# Altium schematic sheet Intercomm_sheet_2.SchDoc
size 594 x 420 mm; SheetNumber: 2; SheetTotal: 3
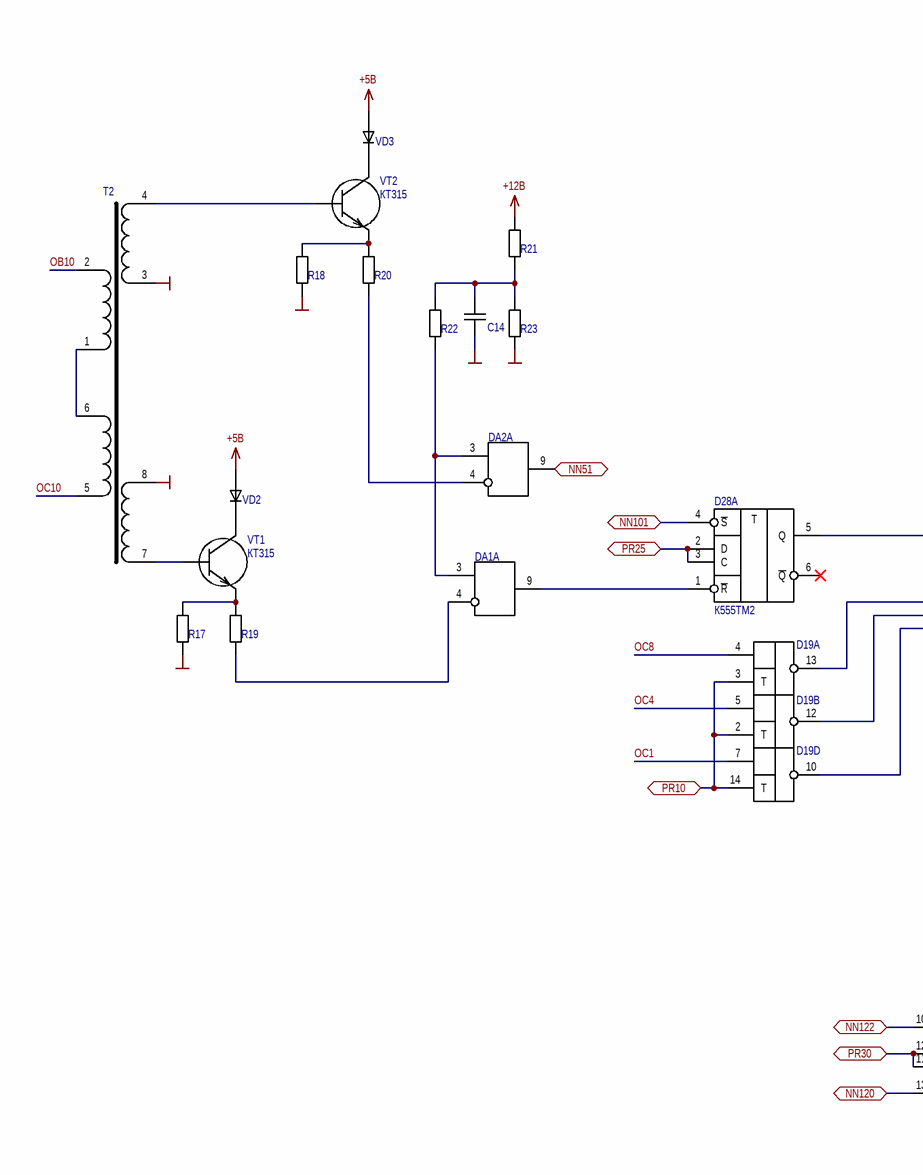
[diagram p0: Intercomm_sheet_2.SchDoc, left]
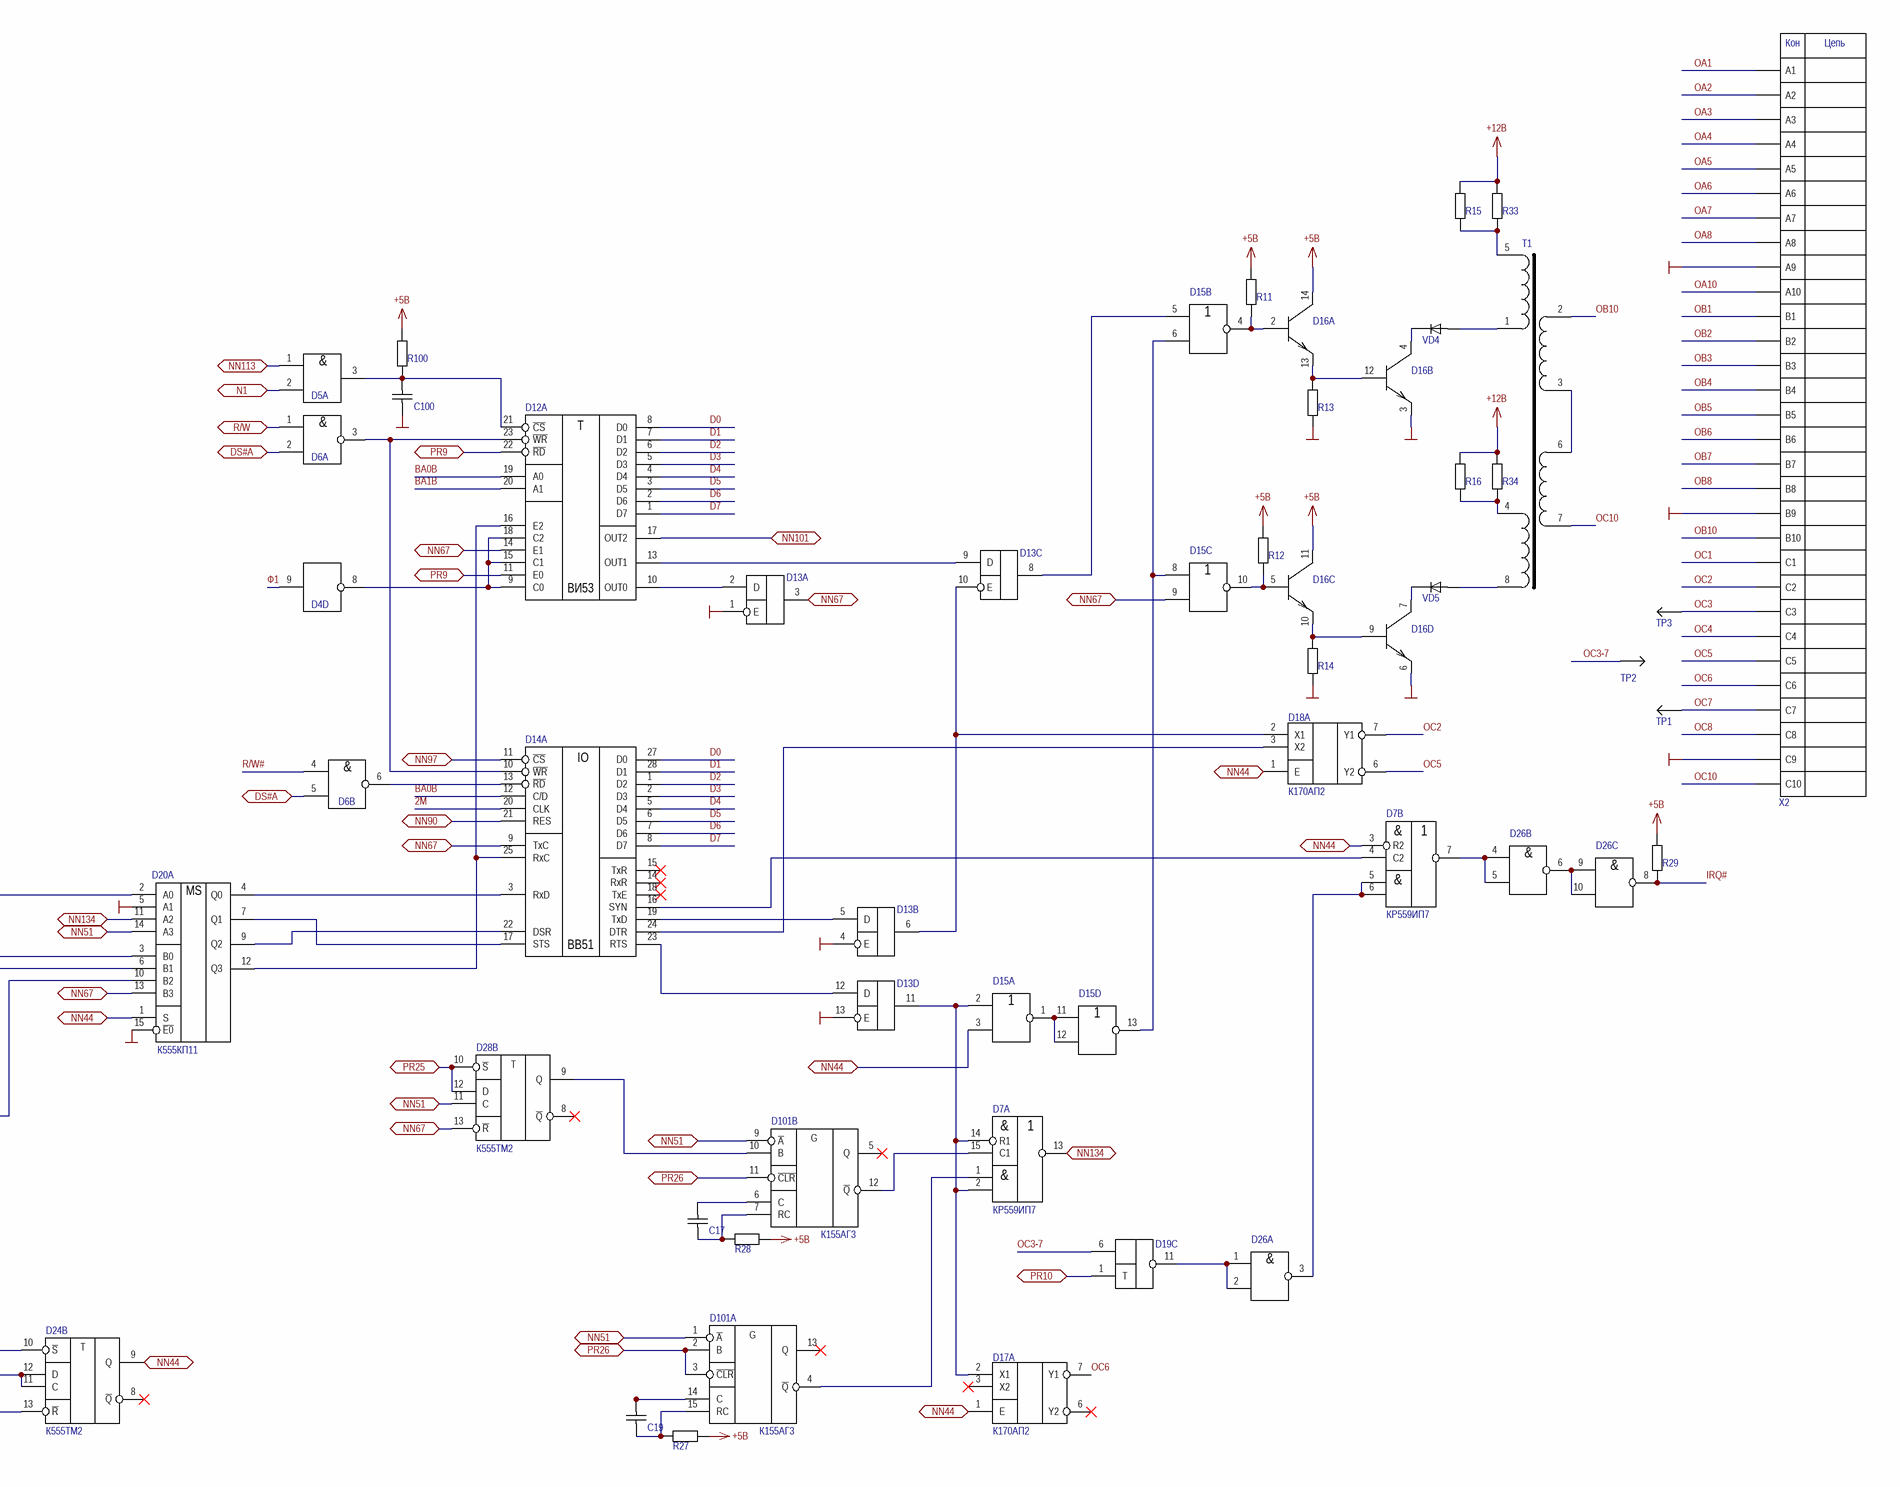
[diagram p1: Intercomm_sheet_2.SchDoc, right]

## Parts
C14  0,1  [C5]  (value not drawn)
C17  0,1  [C5]  (value not drawn)
C19  0,1  [C5]  (value not drawn)
C100  0,1  [C5]  (value not drawn)
D4  К555ТЛ2  [201.14]  (value not drawn)  (part D of 7)
D5  К555ЛИ1  [201.14]  (value not drawn)  (part A of 5)
D6  К555ЛА3  [201.14]  (value not drawn)  (parts A,B of 5)
D7  КР559ИП7  [201.16]  (parts A,B of 4)
D12  КР580ВИ53  [2120.24]  (value not drawn)  (part A of 2)
D13  К555ЛП8  [201.14]  (value not drawn)  (parts A,B,C,D of 5)
D14  КР580ВВ51А  [2121.28]  (value not drawn)  (part A of 2)
D15  К555ЛЕ1  [201.14]  (value not drawn)  (parts A,B,C,D of 5)
D16  1НТ251  [SOP125P1150X265-14N]  (value not drawn)  (parts A,B,C,D of 4)
D17  К170АП2  [2101.8]  (part A of 2)
D18  К170АП2  [2101.8]  (part A of 2)
D19  К170УП2  [201.16]  (value not drawn)  (parts A,B,C,D of 5)
D20  К555КП11  [201.16]  (part A of 2)
D24  К555ТМ2  [201.14]  (part B of 3)
D26  К555ЛА3  [201.14]  (value not drawn)  (parts A,B,C of 5)
D28  К555ТМ2  [201.14]  (parts A,B of 3)
D101  К155АГ3  [201.16]  (parts A,B of 3)
DA1  К554СА2  [201.14]  (value not drawn)  (part A of 2)
DA2  К554СА2  [201.14]  (value not drawn)  (part A of 2)
R11  1K  [R10]  (value not drawn)
R12  1K  [R10]  (value not drawn)
R13  1K  [R10]  (value not drawn)
R14  1K  [R10]  (value not drawn)
R15  1K  [R10]  (value not drawn)
R16  1K  [R10]  (value not drawn)
R17  1K  [R10]  (value not drawn)
R18  1K  [R10]  (value not drawn)
R19  1K  [R10]  (value not drawn)
R20  1K  [R10]  (value not drawn)
R21  1K  [R10]  (value not drawn)
R22  1K  [R10]  (value not drawn)
R23  1K  [R10]  (value not drawn)
R27  1K  [R10]  (value not drawn)
R28  1K  [R10]  (value not drawn)
R29  1K  [R10]  (value not drawn)
R33  1K  [R10]  (value not drawn)
R34  1K  [R10]  (value not drawn)
R100  1K  [R10]  (value not drawn)
T1  COMM_T1  [COMM_T]  (value not drawn)
T2  COMM_T2  [COMM_T]  (value not drawn)
TP1  TEST_PAD  [TEST_PAD]  (value not drawn)
TP2  TEST_PAD  [TEST_PAD]  (value not drawn)
TP3  TEST_PAD  [TEST_PAD]  (value not drawn)
VD2  КД522Б  [DO-35-10mm]  (value not drawn)
VD3  КД522Б  [DO-35-10mm]  (value not drawn)
VD4  КД522Б  [DO-35-10mm]  (value not drawn)
VD5  КД522Б  [DO-35-10mm]  (value not drawn)
VT1  КТ315  [КТ315]
VT2  КТ315  [КТ315]
X2  COMM_OUT  [СНП34-300/27х9,4Р-22-Р]  (value not drawn)

## Ports
DS#A (bidir, see Intercomm_sheet_1[2D], Intercomm_sheet_2[2B]), DS#A (bidir, see Intercomm_sheet_1[2D], Intercomm_sheet_2[2C]), N1 (bidir, see Intercomm_sheet_1[3A]), NN44 (bidir, see Intercomm_sheet_2[2C], Intercomm_sheet_2[2D], Intercomm_sheet_2[3C], Intercomm_sheet_2[3D]), NN44 (bidir, see Intercomm_sheet_2[2C], Intercomm_sheet_2[2D], Intercomm_sheet_2[3C], Intercomm_sheet_2[3D], Intercomm_sheet_2[4C]), NN44 (bidir, see Intercomm_sheet_2[2C], Intercomm_sheet_2[2D], Intercomm_sheet_2[3C], Intercomm_sheet_2[4C]), NN44 (bidir, see Intercomm_sheet_2[2C], Intercomm_sheet_2[3C], Intercomm_sheet_2[3D], Intercomm_sheet_2[4C]), NN44 (bidir, see Intercomm_sheet_2[2D], Intercomm_sheet_2[3C], Intercomm_sheet_2[3D], Intercomm_sheet_2[4C]), NN51 (bidir, see Intercomm_sheet_2[1C], Intercomm_sheet_2[2C], Intercomm_sheet_2[2D], Intercomm_sheet_2[3D]), NN51 (bidir, see Intercomm_sheet_2[1C], Intercomm_sheet_2[2C], Intercomm_sheet_2[3D]), NN51 (bidir, see Intercomm_sheet_2[1C], Intercomm_sheet_2[2D], Intercomm_sheet_2[3D]), NN51 (bidir, see Intercomm_sheet_2[2C], Intercomm_sheet_2[2D], Intercomm_sheet_2[3D]), NN67 (bidir, see Intercomm_sheet_2[2B], Intercomm_sheet_2[2C], Intercomm_sheet_2[2D], Intercomm_sheet_2[3C]), NN67 (bidir, see Intercomm_sheet_2[2B], Intercomm_sheet_2[2C], Intercomm_sheet_2[3C]), NN67 (bidir, see Intercomm_sheet_2[2C], Intercomm_sheet_2[2D], Intercomm_sheet_2[3C]), NN90 (bidir, see Intercomm_sheet_1[4A]), NN97 (bidir, see Intercomm_sheet_1[3A]), NN101 (bidir, see Intercomm_sheet_2[1C]), NN101 (bidir, see Intercomm_sheet_2[3B]), NN113 (bidir, see Intercomm_sheet_1[3A]), NN120 (bidir, see Intercomm_sheet_1[3A]), NN122 (bidir, see Intercomm_sheet_1[3A]), NN134 (bidir, see Intercomm_sheet_2[2C]), NN134 (bidir, see Intercomm_sheet_2[3D]), PR9 (bidir, see Intercomm_sheet_1[1B], Intercomm_sheet_1[1D], Intercomm_sheet_2[2B], Intercomm_sheet_3[4A]), PR10 (bidir, see Intercomm_sheet_2[1D], Intercomm_sheet_3[4A]), PR10 (bidir, see Intercomm_sheet_2[3D], Intercomm_sheet_3[4A]), PR25 (bidir, see Intercomm_sheet_2[1C], Intercomm_sheet_3[4A]), PR25 (bidir, see Intercomm_sheet_2[2C], Intercomm_sheet_3[4A]), PR26 (bidir, see Intercomm_sheet_2[3D], Intercomm_sheet_3[4B]), PR30 (bidir, see Intercomm_sheet_3[4B]), R/W (bidir, see Intercomm_sheet_1[2D], Intercomm_sheet_1[3B])

## Nets
+5В: D16.11(C) D16.14(C) R11.2 R12.2 R27.2 R28.2 R29.2 R100.2 VD2.1 VD3.1
+12В: R15.1 R16.1 R21.2 R33.1 R34.1
GND: C14.2 C100.2 D13.1(E) D13.4(E) D13.13(E) D16.3(E) D16.6(E) D20.5(A1) D20.15(~{E0}) R13.2 R14.2 R17.2 R18.2 R23.2 T2.3 T2.8 X2.A9 X2.B9 X2.C9
2M: D14.20(CLK)
BA0B: D12.19(A0) D14.12(C/D)
BA1B: D12.20(A1)
D0: D12.8(D0) D14.27(D0)
D1: D12.7(D1) D14.28(D1)
D2: D12.6(D2) D14.1(D2)
D3: D12.5(D3) D14.2(D3)
D4: D12.4(D4) D14.5(D4)
D5: D12.3(D5) D14.6(D5)
D6: D12.2(D6) D14.7(D6)
D7: D12.1(D7) D14.8(D7)
DS#A: D6.2(B) D6.5(B) ; port DS#A
IRQ#: D26.8(~{O}) R29.1
N1: D5.2(B) ; port N1
NN44: D7.3(R2) D15.3(B) D17.1(E) D18.1(E) D20.1(S) D24.9(Q) ; port NN44
NN51: D20.14(A3) D28.11(C) D101.1(~{A}) D101.9(~{A}) DA2.9(OUT) ; port NN51
NN67: D12.14(E1) D13.3(O) D14.9(TxC) D15.9(B) D20.13(B3) D28.13(~{R}) ; port NN67
NN90: D14.21(RES) ; port NN90
NN97: D14.11(~{CS}) ; port NN97
NN101: D12.17(OUT2) D28.4(~{S}) ; port NN101
NN113: D5.1(A) ; port NN113
NN120: D24.13(~{R}) ; port NN120
NN122: D24.10(~{S}) ; port NN122
NN134: D7.13(~{O}) D20.11(A2) ; port NN134
OA1: X2.A1
OA2: X2.A2
OA3: X2.A3
OA4: X2.A4
OA5: X2.A5
OA6: X2.A6
OA7: X2.A7
OA8: X2.A8
OA10: X2.A10
OB1: X2.B1
OB2: X2.B2
OB3: X2.B3
OB4: X2.B4
OB5: X2.B5
OB6: X2.B6
OB7: X2.B7
OB8: X2.B8
OB10: T1.2 T2.2 X2.B10
OC1: D19.7(IN) X2.C1
OC2: D18.7(Y1) X2.C2
OC3: TP3.1 X2.C3
OC3-7: D19.6(IN) TP2.1
OC4: D19.5(IN) X2.C4
OC5: D18.6(Y2) X2.C5
OC6: D17.7(Y1) X2.C6
OC7: TP1.1 X2.C7
OC8: D19.4(IN) X2.C8
OC10: T1.7 T2.5 X2.C10
PR9: D12.11(E0) D12.22(~{RD}) ; port PR9
PR10: D19.1(T) D19.2(T) D19.3(T) D19.14(T) ; port PR10
PR25: D28.2(D) D28.3(C) D28.10(~{S}) D28.12(D) ; port PR25
PR26: D101.2(B) D101.3(~{CLR}) D101.11(~{CLR}) ; port PR26
PR30: D24.11(C) D24.12(D) ; port PR30
R/W: D6.1(A) ; port R/W
R/W#: D6.4(A)
Ф1: D4.9(A)
NetC14_1: C14.1 R21.1 R22.1 R23.1
NetC17_1: C17.1 D101.6(C)
NetC17_2: C17.2 D101.7(RC) R28.1
NetC19_1: C19.1 D101.14(C)
NetC19_2: C19.2 D101.15(RC) R27.1
NetC100_1: C100.1 D5.3(O) D12.21(~{CS}) R100.1
NetD4_8: D4.8(~{O}) D12.9(C0) D12.15(C1) D12.18(C2)
NetD6_3: D6.3(~{O}) D12.23(~{WR}) D14.10(~{WR})
NetD6_6: D6.6(~{O}) D14.13(~{RD})
NetD7_1: D7.1(A) D101.4(~{Q})
NetD7_2: D7.2(B) D7.14(R1) D13.11(O) D15.2(A) D17.2(X1)
NetD7_4: D7.4(C2) D14.16(SYN)
NetD7_5: D7.5(A) D7.6(B) D26.3(~{O})
NetD7_7: D7.7(~{O}) D26.4(A) D26.5(B)
NetD7_15: D7.15(C1) D101.12(~{Q})
NetD12_10: D12.10(OUT0) D13.2(D)
NetD12_13: D12.13(OUT1) D13.9(D)
NetD12_16: D12.16(E2) D14.25(RxC) D20.12(Q3)
NetD13_5: D13.5(D) D14.19(TxD)
NetD13_6: D13.6(O) D13.10(E) D18.2(X1)
NetD13_8: D13.8(O) D15.5(A)
NetD13_12: D13.12(D) D14.23(RTS)
NetD14_3: D14.3(RxD) D20.4(Q0)
NetD14_17: D14.17(STS) D20.7(Q1)
NetD14_22: D14.22(DSR) D20.9(Q2)
NetD14_24: D14.24(DTR) D18.3(X2)
NetD15_1: D15.1(~{O}) D15.11(A) D15.12(B)
NetD15_4: D15.4(~{O}) D16.2(B) R11.1
NetD15_6: D15.6(B) D15.8(A) D15.13(~{O})
NetD15_10: D15.10(~{O}) D16.5(B) R12.1
NetD16_4: D16.4(C) VD4.2
NetD16_7: D16.7(C) VD5.2
NetD16_9: D16.9(B) D16.10(E) R14.1
NetD16_12: D16.12(B) D16.13(E) R13.1
NetD19_10: D19.10(OUT) D20.10(B2)
NetD19_11: D19.11(OUT) D26.1(A) D26.2(B)
NetD19_12: D19.12(OUT) D20.6(B1)
NetD19_13: D19.13(OUT) D20.3(B0)
NetD20_2: D20.2(A0) D28.5(Q)
NetD26_6: D26.6(~{O}) D26.9(A) D26.10(B)
NetD28_1: D28.1(~{R}) DA1.9(OUT)
NetD28_9: D28.9(Q) D101.10(B)
NetDA1_3: DA1.3(IN) DA2.3(IN) R22.2
NetDA1_4: DA1.4(~{IN}) R19.2
NetDA2_4: DA2.4(~{IN}) R20.2
NetR15_2: R15.2 R33.2 T1.5
NetR16_2: R16.2 R34.2 T1.4
NetR17_1: R17.1 R19.1 VT1.E
NetR18_1: R18.1 R20.1 VT2.E
NetT1_1: T1.1 VD4.1
NetT1_3: T1.3 T1.6
NetT1_8: T1.8 VD5.1
NetT2_1: T2.1 T2.6
NetT2_4: T2.4 VT2.B
NetT2_7: T2.7 VT1.B
NetVD2_2: VD2.2 VT1.C
NetVD3_2: VD3.2 VT2.C

Not connected (* = marked no-connect by the designer): D14 14(RxR)* 15(TxR)* 18(TxE)*; D17 3(X2)* 6(Y2)*; D24 8(~{Q})*; D28 6(~{Q})* 8(~{Q})*; D101 5(Q)* 13(Q)*

## Notes on the sheet
- Подп. и дата
- Инв. № дубл.
- Взам. инв. №
- Инв. № подл.
- Изм.
- Лист
- № докум.
- Подп.
- Дата
- 2.106-A2
- Копировал
- Формат А2
- (in symbol COMM_OUT) Кон; Цепь
- (in symbol К155АГ3, part A) G
- (in symbol К155АГ3, part B) G
- (in symbol К555КП11, part A) MS
- (in symbol К555ЛА3, part A) &
- (in symbol К555ЛА3, part B) &
- (in symbol К555ЛА3, part C) &
- (in symbol К555ЛИ1, part A) &
- (in symbol К555ТМ2, part A) T
- (in symbol К555ТМ2, part B) T
- (in symbol КР559ИП7, part A) &
- (in symbol КР559ИП7, part B) &
- (in symbol КР580ВВ51А, part A) IO; ВВ51
- (in symbol КР580ВИ53, part A) T; ВИ53

## Library data of the parts
C14 C17 C19 C100 = К10-17: Value: 0,1
D7 = КР559ИП7: ManufacturerPartNumber: К555ЛА3
D15 = К555ЛЕ1: ManufacturerPartNumber: К555ЛА3
R11-R23 R27-R29 R33 R34 R100 = С2-23: Резистор; Value: 1K
D5 = К555ЛИ1: ManufacturerPartNumber: К555ЛИ1
D6 D26 = К555ЛА3: ManufacturerPartNumber: К555ЛА3
D20 = К555КП11: ManufacturerPartNumber: К555КП11